# EAGLE design Thruster Ctl (EAGLE 5.11)
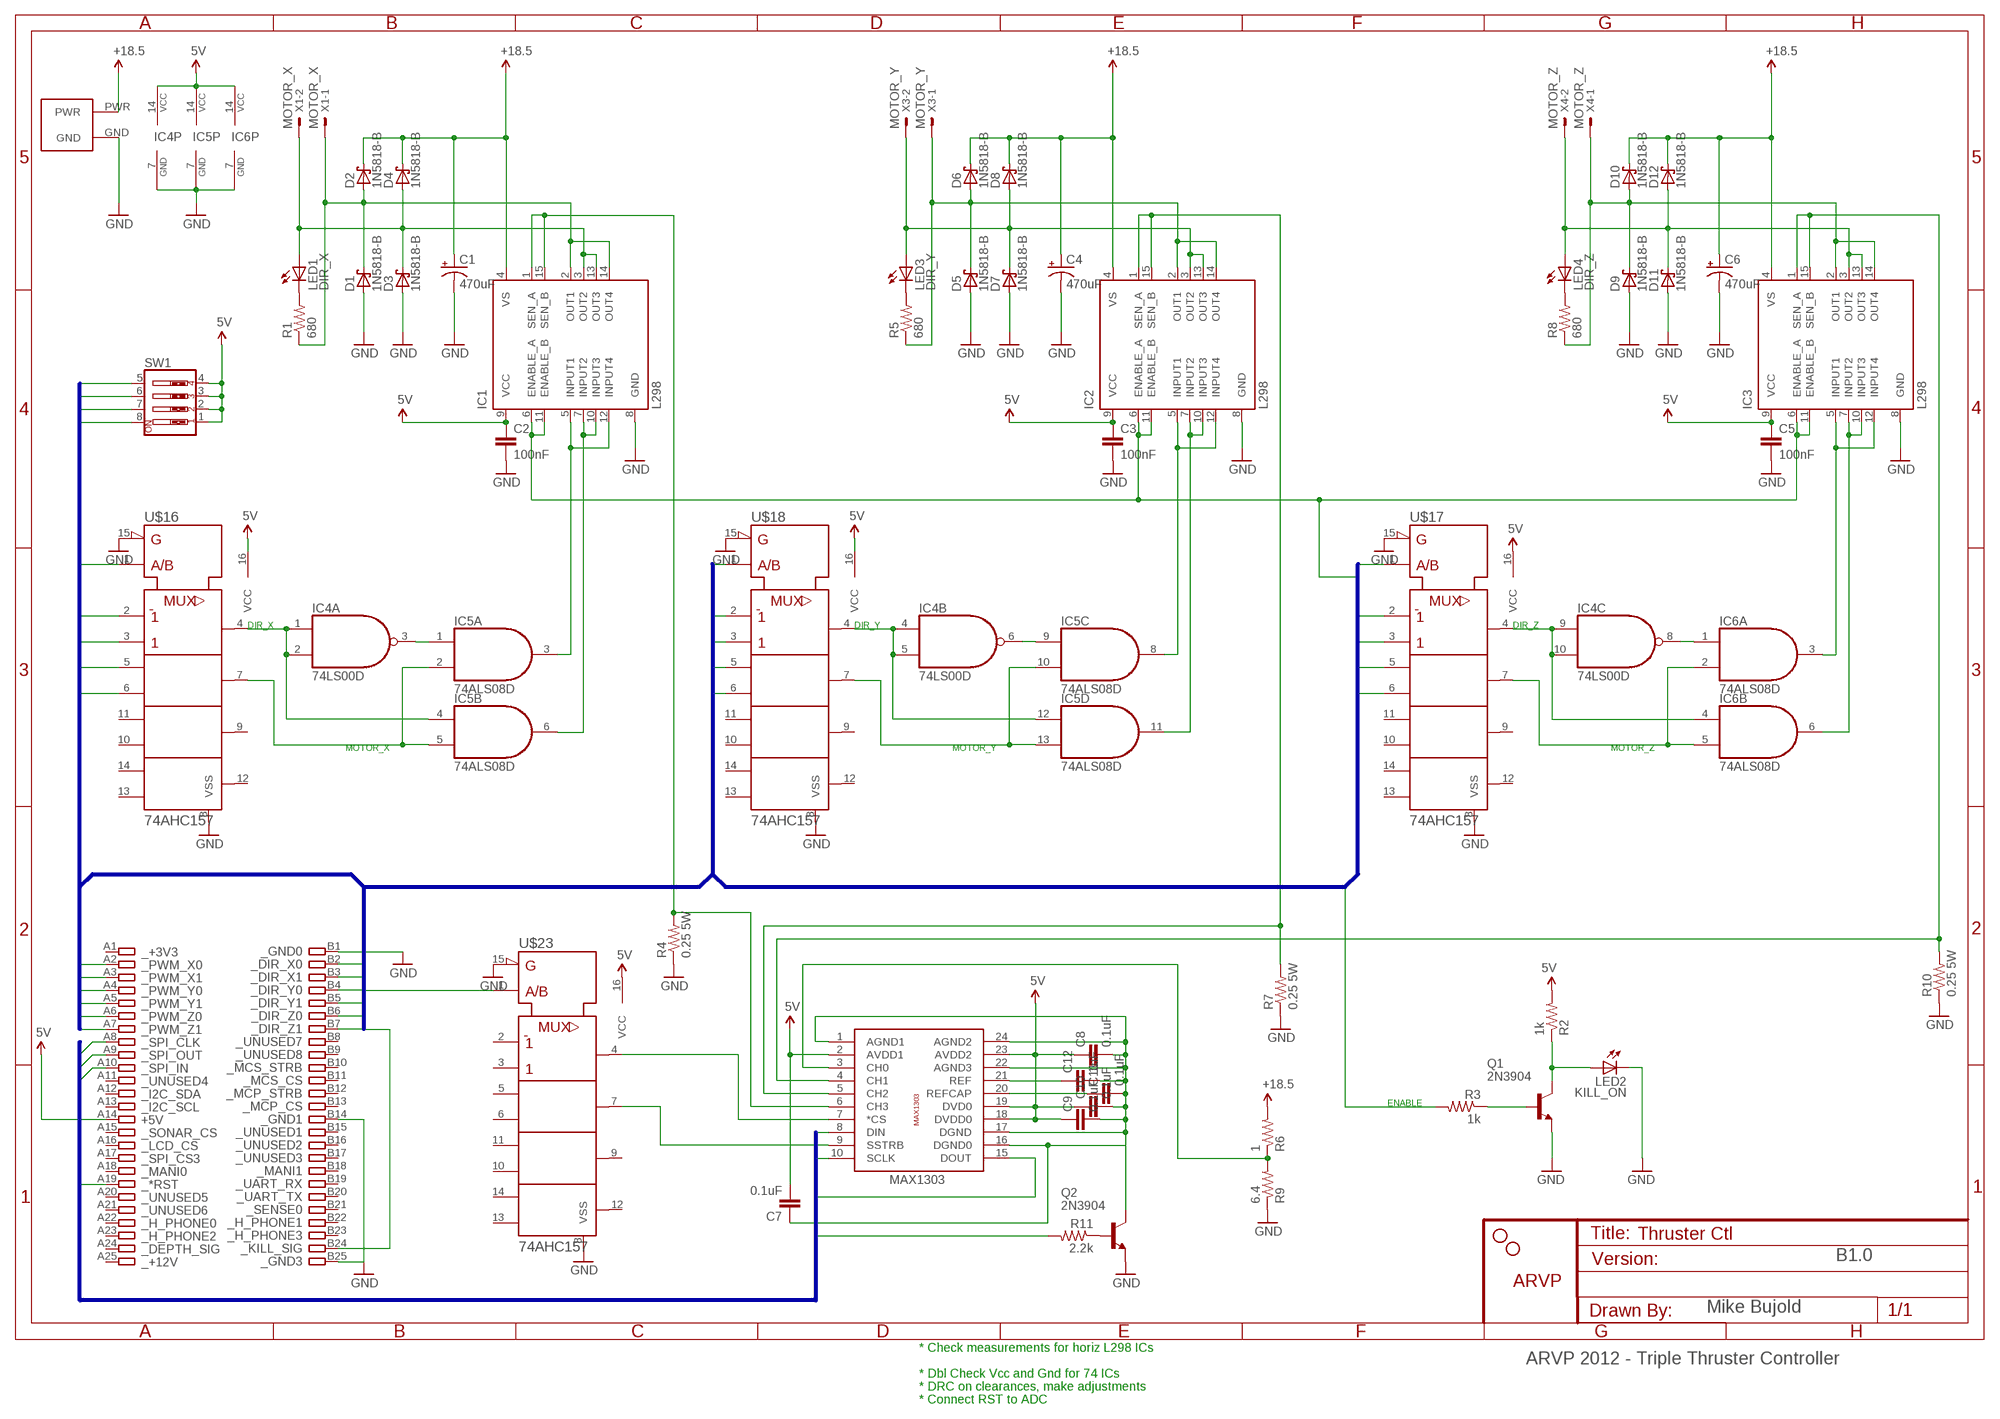
[diagram p0: schematic, sheet 1]

## Parts
C1  470uF  CAP_POLPTH4  [CPOL-RADIAL-1000UF-25V]
C2  100nF  CAPPTH  [CAP-PTH-SMALL]
C3  100nF  CAPPTH  [CAP-PTH-SMALL]
C4  470uF  CAP_POLPTH4  [CPOL-RADIAL-1000UF-25V]
C5  100nF  CAPPTH  [CAP-PTH-SMALL]
C6  470uF  CAP_POLPTH4  [CPOL-RADIAL-1000UF-25V]
C7  0.1uF  CAP1206  [1206]
C8  0.1uF  CAP1206  [1206]
C9  0.1uF  CAP1206  [1206]
C10  0.1uF  CAP1206  [1206]
C11  0.1uF  CAP1206  [1206]
C12  1uF  CAP1206  [1206]
D1  1N5818-B  [DO41-7.6]
D2  1N5818-B  [DO41-7.6]
D3  1N5818-B  [DO41-7.6]
D4  1N5818-B  [DO41-7.6]
D5  1N5818-B  [DO41-7.6]
D6  1N5818-B  [DO41-7.6]
D7  1N5818-B  [DO41-7.6]
D8  1N5818-B  [DO41-7.6]
D9  1N5818-B  [DO41-7.6]
D10  1N5818-B  [DO41-7.6]
D11  1N5818-B  [DO41-7.6]
D12  1N5818-B  [DO41-7.6]
IC1  L298  [MULTIWATT-15]
IC2  L298  [MULTIWATT-15]
IC3  L298  [MULTIWATT-15]
IC4  74LS00D  [SO14]
IC5  74ALS08D  [SO14]
IC6  74ALS08D  [SO14]
JP1  STAND-OFF  [STAND-OFF]
JP3  STAND-OFF  [STAND-OFF]
LED1  DIR_X  LED5MM  [LED5MM]
LED2  KILL_ON  LED5MM  [LED5MM]
LED3  DIR_Y  LED5MM  [LED5MM]
LED4  DIR_Z  LED5MM  [LED5MM]
Q1  2N3904  [TO92]
Q2  2N3904  [TO92]
R1  680  RESISTORPTH-1/4W  [AXIAL-0.4]
R2  1k  RESISTORPTH-1/4W  [AXIAL-0.4]
R3  1k  RESISTORPTH-1/4W  [AXIAL-0.4]
R4  0.25 5W  R-US_0922/22  [0922/22]
R5  680  RESISTORPTH-1/4W  [AXIAL-0.4]
R6  1  RESISTORPTH-1/4W  [AXIAL-0.4]
R7  0.25 5W  R-US_0922/22  [0922/22]
R8  680  RESISTORPTH-1/4W  [AXIAL-0.4]
R9  6.4  RESISTORPTH-1/4W  [AXIAL-0.4]
R10  0.25 5W  R-US_0922/22  [0922/22]
R11  2.2k  RESISTORPTH-1/4W  [AXIAL-0.4]
SW1  SW_DIP-4  [EDG-04]
U$4  ARVP_LOGO  [ARVP]
U$7  AND_PWR  [AND_PWR]
U$13  MAX1303  [MAX1303]
U$16  74AHC157  [TSSOP-16]
U$17  74AHC157  [TSSOP-16]
U$18  74AHC157  [TSSOP-16]
U$19  CARD_50PIN  [CARD_50PIN]
U$23  74AHC157  [TSSOP-16]
X1  MOTOR_X  KK-156-2  [KK-156-2]
X3  MOTOR_Y  KK-156-2  [KK-156-2]
X4  MOTOR_Z  KK-156-2  [KK-156-2]

## Nets
5V: C2.1 C3.1 C5.1 C7.2 C8.1 C9.1 C10.1 IC1.9(VCC) IC2.9(VCC) IC3.9(VCC) IC4.14(P:VCC) IC5.14(P:VCC) IC6.14(P:VCC) R2.P$2 SW1.1 SW1.2 SW1.3 SW1.4 U$13.2(AVDD1) U$13.18(DVDD0) U$13.19(DVD0) U$13.23(AVDD2) U$16.16(VCC) U$17.16(VCC) U$18.16(VCC) U$19.A14 U$23.16(VCC)
18.5V: C1.1(+) C4.1(+) C6.1(+) D2.C D4.C D6.C D8.C D10.C D12.C IC1.4(VS) IC2.4(VS) IC3.4(VS) R6.P$2 U$7.PWR ; supply symbol labelled +18.5
*RST: R11.P$2 U$19.A19
_SPI_CLK: U$13.10(SCLK) U$19.A8
_SPI_IN: U$13.15(DOUT) U$19.A10
_SPI_OUT: U$13.8(DIN) U$19.A9
DIR_X0: U$16.3(1B) U$19.B2
DIR_X1: U$16.2(1A) U$19.B3
DIR_Y0: U$18.3(1B) U$19.B4
DIR_Y1: U$18.2(1A) U$19.B5
DIR_Z0: U$17.3(1B) U$19.B6
DIR_Z1: U$17.2(1A) U$19.B7
GND: C1.2(-) C2.2 C3.2 C4.2(-) C5.2 C6.2(-) D1.A D3.A D5.A D7.A D9.A D11.A IC1.8(GND) IC2.8(GND) IC3.8(GND) IC4.7(P:GND) IC5.7(P:GND) IC6.7(P:GND) LED2.K(C) Q1.3(E) Q2.3(E) R4.1 R7.1 R9.P$1 R10.1 U$7.GND U$16.8(VSS) U$16.15(!G) U$17.8(VSS) U$17.15(!G) U$18.8(VSS) U$18.15(!G) U$19.B1 U$19.B14 U$19.B25 U$23.8(VSS) U$23.15(!G)
KILL: IC1.6(ENABLE_A) IC1.11(ENABLE_B) IC2.6(ENABLE_A) IC2.11(ENABLE_B) IC3.6(ENABLE_A) IC3.11(ENABLE_B) R3.P$2 U$19.B24
N$1: IC5.10(C:I1) IC5.13(D:I1) U$18.7(2Y)
N$3: LED2.A Q1.1(C) R2.P$1
N$4: IC2.5(INPUT1) IC2.12(INPUT4) IC5.8(C:O)
N$5: IC1.5(INPUT1) IC1.12(INPUT4) IC5.3(A:O)
N$6: IC1.7(INPUT2) IC1.10(INPUT3) IC5.6(B:O)
N$7: D1.C D2.A IC1.2(OUT1) IC1.14(OUT4) R1.P$1 X1.1
N$8: D3.C D4.A IC1.3(OUT2) IC1.13(OUT3) LED1.A X1.2
N$9: LED1.K(C) R1.P$2
N$10: IC2.7(INPUT2) IC2.10(INPUT3) IC5.11(D:O)
N$11: D5.C D6.A IC2.2(OUT1) IC2.14(OUT4) R5.P$1 X3.1
N$12: D7.C D8.A IC2.3(OUT2) IC2.13(OUT3) LED3.A X3.2
N$13: IC4.8(C:O) IC6.1(A:I0)
N$14: LED3.K(C) R5.P$2
N$16: IC3.5(INPUT1) IC3.12(INPUT4) IC6.3(A:O)
N$17: IC3.7(INPUT2) IC3.10(INPUT3) IC6.6(B:O)
N$18: D9.C D10.A IC3.2(OUT1) IC3.14(OUT4) R8.P$1 X4.1
N$19: D11.C D12.A IC3.3(OUT2) IC3.13(OUT3) LED4.A X4.2
N$21: LED4.K(C) R8.P$2
N$22: C7.1 C8.2 C9.2 C10.2 C11.2 C12.2 Q2.1(C) U$13.1(AGND1) U$13.16(DGND0) U$13.17(DGND) U$13.22(AGND3) U$13.24(AGND2)
N$23: IC6.2(A:I1) IC6.5(B:I1) U$17.7(2Y)
N$24: IC3.1(SEN_A) IC3.15(SEN_B) R10.2 U$13.4(CH1)
N$25: IC4.6(B:O) IC5.9(C:I0)
N$26: IC5.2(A:I1) IC5.5(B:I1) U$16.7(2Y)
N$27: IC4.3(A:O) IC5.1(A:I0)
N$28: Q1.2(B) R3.P$1
N$29: IC2.1(SEN_A) IC2.15(SEN_B) R7.2 U$13.5(CH2)
N$30: IC1.1(SEN_A) IC1.15(SEN_B) R4.2 U$13.6(CH3)
N$32: U$13.7(*CS) U$23.4(1Y)
N$33: C11.1 U$13.20(REFCAP)
N$34: C12.1 U$13.21(REF)
N$35: U$13.9(SSTRB) U$23.7(2Y)
N$36: IC4.1(A:I0) IC4.2(A:I1) IC5.4(B:I0) U$16.4(1Y)
N$37: IC4.4(B:I0) IC4.5(B:I1) IC5.12(D:I0) U$18.4(1Y)
N$38: IC4.9(C:I0) IC4.10(C:I1) IC6.4(B:I0) U$17.4(1Y)
N$39: R6.P$1 R9.P$2 U$13.3(CH0)
N$40: Q2.2(B) R11.P$1
PWM_X0: U$16.6(2B) U$19.A2
PWM_X1: U$16.5(2A) U$19.A3
PWM_Y0: U$18.6(2B) U$19.A4
PWM_Y1: U$18.5(2A) U$19.A5
PWM_Z0: U$17.6(2B) U$19.A6
PWM_Z1: U$17.5(2A) U$19.A7
SEL_X: SW1.8 U$16.1(!A/B)
SEL_Y: SW1.7 U$18.1(!A/B)
SEL_Z: SW1.6 U$17.1(!A/B)
SIDE: SW1.5 U$23.1(!A/B)
Unconnected: IC4.11(D:O) IC4.12(D:I0) IC4.13(D:I1) IC6.8(C:O) IC6.9(C:I0) IC6.10(C:I1) IC6.11(D:O) IC6.12(D:I0) IC6.13(D:I1) U$16.9(3Y) U$16.10(3B) U$16.11(3A) U$16.12(4Y) U$16.13(4B) U$16.14(4A) U$17.9(3Y) U$17.10(3B) U$17.11(3A) U$17.12(4Y) U$17.13(4B) U$17.14(4A) U$18.9(3Y) U$18.10(3B) U$18.11(3A) U$18.12(4Y) U$18.13(4B) U$18.14(4A) U$19.A1 U$19.A11 U$19.A12 U$19.A13 U$19.A15 U$19.A16 U$19.A17 U$19.A18 U$19.A20 U$19.A21 U$19.A22 U$19.A23 U$19.A24 U$19.A25 U$19.B8 U$19.B9 U$19.B10 U$19.B11 U$19.B12 U$19.B13 U$19.B15 U$19.B16 U$19.B17 U$19.B18 U$19.B19 U$19.B20 U$19.B21 U$19.B22 U$19.B23 U$23.2(1A) U$23.3(1B) U$23.5(2A) U$23.6(2B) U$23.9(3Y) U$23.10(3B) U$23.11(3A) U$23.12(4Y) U$23.13(4B) U$23.14(4A)

## Buses
_SPI_IN,_SPI_OUT,_SPI_CLK,_ADC_CS,ADC_STRB,*RST
PWM_X0,DIR_X0,PWM_X1,DIR_X1,PWM_Y0,DIR_Y0,PWM_Y1,DIR_Y1,PWM_Z0,DIR_Z0,PWM_Z1,DIR_Z1,SEL_X,SEL_Y,SEL_Z,KILL,SIDE

## Notes on the sheet
- DIR_X | DIR_Y | DIR_Z
- MOTOR_X | MOTOR_Y | MOTOR_Z
- ENABLE
- B1.0
- Mike Bujold
- * Check measurements for horiz L298 ICs
- ARVP 2012 - Triple Thruster Controller
- * Dbl Check Vcc and Gnd for 74 ICs
- * DRC on clearances, make adjustments
- * Connect RST to ADC

## Library data of the parts
C1 C4 C6 = SparkFun:CAP_POL: Capacitor Polarized These are standard SMD and PTH capacitors. Normally 10uF, 47uF, and 100uF in electrolytic and tantalum varieties. Always verify the external diameter of the through hole cap, it varies with capacity, voltage, and manufacturer. The EIA devices should be standard.
C2 C3 C5 C7-C12 = SparkFun:CAP: Capacitor Standard 0603 ceramic capacitor, and 0.1" leaded capacitor.
D1-D12 = diode:1N581*: 1.0A SCHOTTKY BARRIER RECTIFIER Source: http://www.diodes.com/datasheets/ds23001.pdf
IC1-IC3 = st-microelectronics:L298: DUAL FULL-BRIDGE DRIVER; MPN: L298N; OC_FARNELL: 1589425; OC_NEWARK: 32M1527
IC4 = 74xx-us:74*00: Quad 2-input NAND gate
IC5 IC6 = 74xx-us:74*08: Quad 2-input AND gate
JP1 JP3 = SparkFun:STAND-OFF: Stand Off This is the mechanical footprint for a #4 phillips button head screw. Use the keepout ring to avoid running the screw head into surrounding components. SKU : PRT-00447
LED1-LED4 = led:LED: LED OSRAM: - CHIPLED LG R971, LG N971, LY N971, LG Q971, LY Q971, LO R971, LY R971 LH N974, LH R974 LS Q976, LO Q976, LY Q976 LO Q996 - Hyper CHIPLED LW Q18S LB Q993, LB Q99A, LB R99A - SideLED LS A670, LO A670, LY A670, LG A670, LP A670 LB A673, LV A673, LT A673, LW A673 LH A674 LY A675 LS A676, LA A676, LO A676, LY A676, LW A676 LS A679, LY A679, LG A679 - Hyper Micro SIDELED® LS Y876, LA Y876, LO Y876, LY Y876 LT Y87S - SmartLED LW L88C, LW L88S LB L89C, LB L89S, LG L890 LS L89K, LO L89K, LY L89K LS L896, LA L896, LO L896, LY L896 - TOPLED LS T670, LO T670, LY T670, LG T670, LP T670 LSG T670, LSP T670, LSY T670, LOP T670, LYG T670 LG T671, LOG T671, LSG T671 LB T673, LV T673, LT T673, LW T673 LH T674 LS T676, LA T676, LO T676, LY T676, LB T676, LH T676, LSB T676, LW T676 LB T67C, LV T67C, LT T67C, LS T67K, LO T67K, LY T67K, LW E67C LS E67B, LA E67B, LO E67B, LY E67B, LB E67C, LV E67C, LT E67C LW T67C LS T679, LY T679, LG T679 LS T770, LO T770, LY T770, LG T770, LP T770 LB T773, LV T773, LT T773, LW T773 LH T774 LS E675, LA E675, LY E675, LS T675 LS T776, LA T776, LO T776, LY T776, LB T776 LHGB T686 LT T68C, LB T68C - Hyper Mini TOPLED® LB M676 - Mini TOPLED Santana® LG M470 LS M47K, LO M47K, LY M47K Source: http://www.osram.convergy.de LUXEON: - LUMILED® LXK2-PW12-R00, LXK2-PW12-S00, LXK2-PW14-U00, LXK2-PW14-V00 LXK2-PM12-R00, LXK2-PM12-S00, LXK2-PM14-U00 LXK2-PE12-Q00, LXK2-PE12-R00, LXK2-PE12-S00, LXK2-PE14-T00, LXK2-PE14-U00 LXK2-PB12-K00, LXK2-PB12-L00, LXK2-PB12-M00, LXK2-PB14-N00, LXK2-PB14-P00, LXK2-PB14-Q00 LXK2-PR12-L00, LXK2-PR12-M00, LXK2-PR14-Q00, LXK2-PR14-R00 LXK2-PD12-Q00, LXK2-PD12-R00, LXK2-PD12-S00 LXK2-PH12-R00, LXK2-PH12-S00 LXK2-PL12-P00, LXK2-PL12-Q00, LXK2-PL12-R00 Source: www.luxeon.com KINGBRIGHT: KA-3528ASYC Source: www.kingbright.com
Q1 Q2 = transistor-npn:2N3904: NPN Transistor
R1-R3 R5 R6 R8 R9 R11 = SparkFun:RESISTOR: Resistor Basic schematic elements and footprints for 0603, 1206, and PTH resistors.
R4 R7 R10 = resistor:R-US_: RESISTOR, American symbol
SW1 = special:SW_DIP-4: DIP SWITCH
U$4 = ARVP:ARVP_LOGO
U$7 = ARVP:AND_PWR
U$13 = ARVP:MAX1303
U$16-U$18 U$23 = ARVP:74AHC157
U$19 = ARVP:CARD_50PIN
X1 X3 X4 = con-molex:KK-156-2: KK 156 HEADER Source: http://www.molex.com/pdm_docs/sd/026604100_sd.pdf; OC_FARNELL: unknown; OC_NEWARK: unknown

## Board
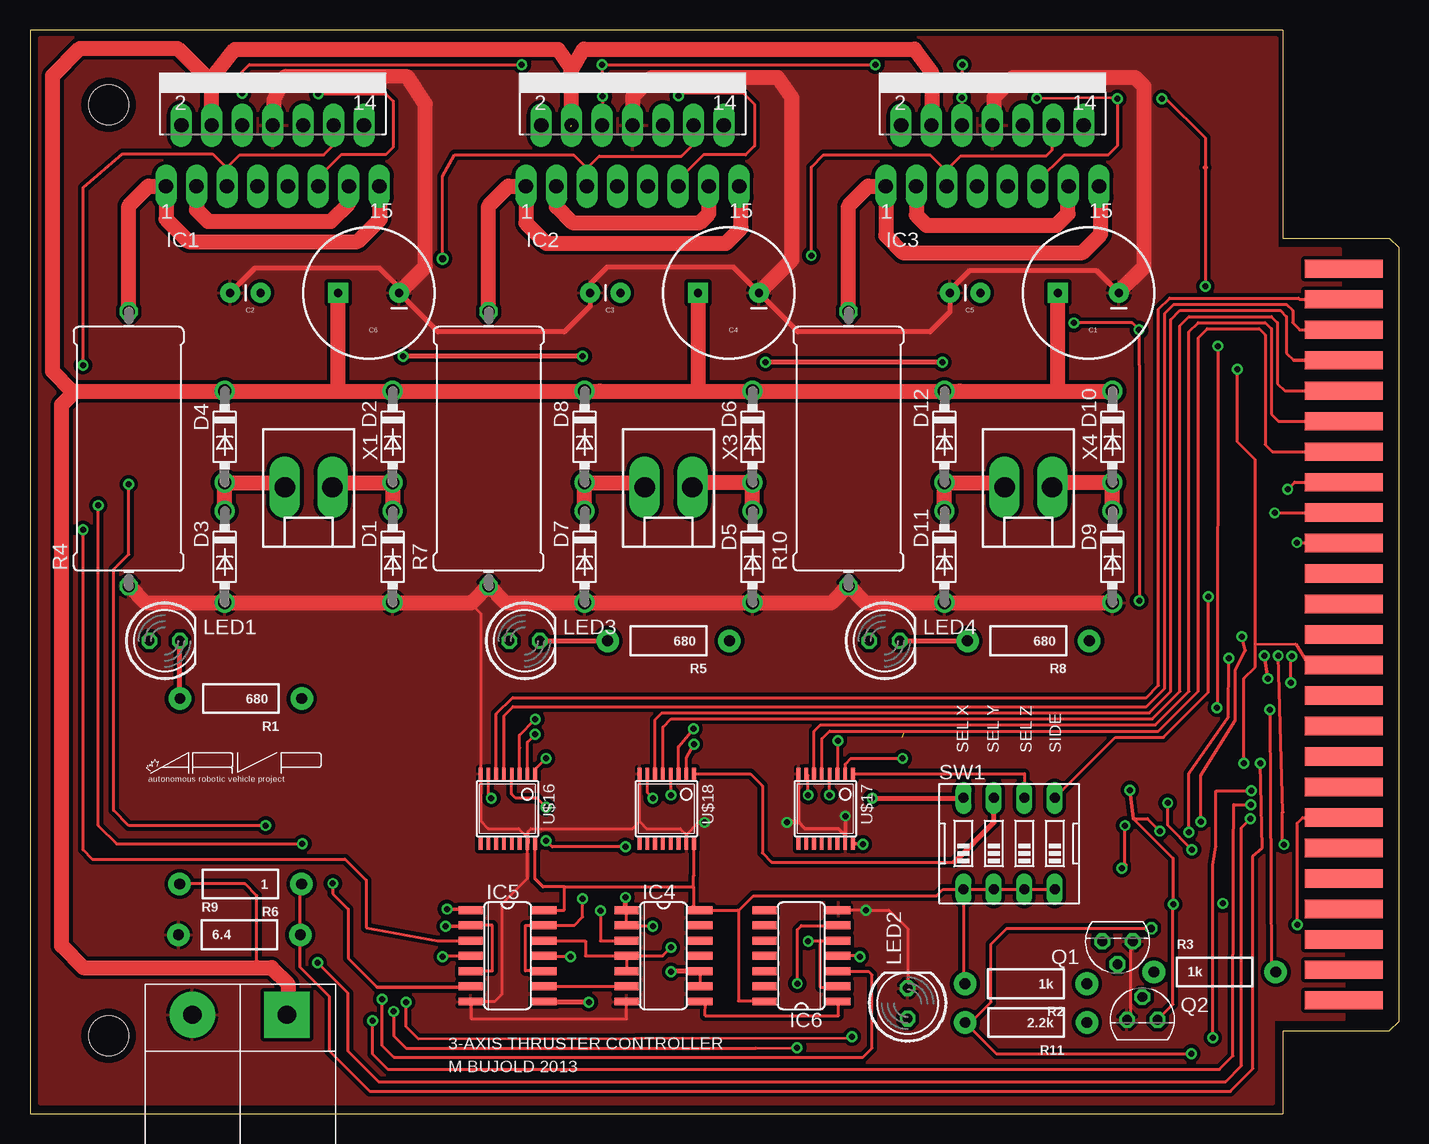
[diagram p1: board, top side]
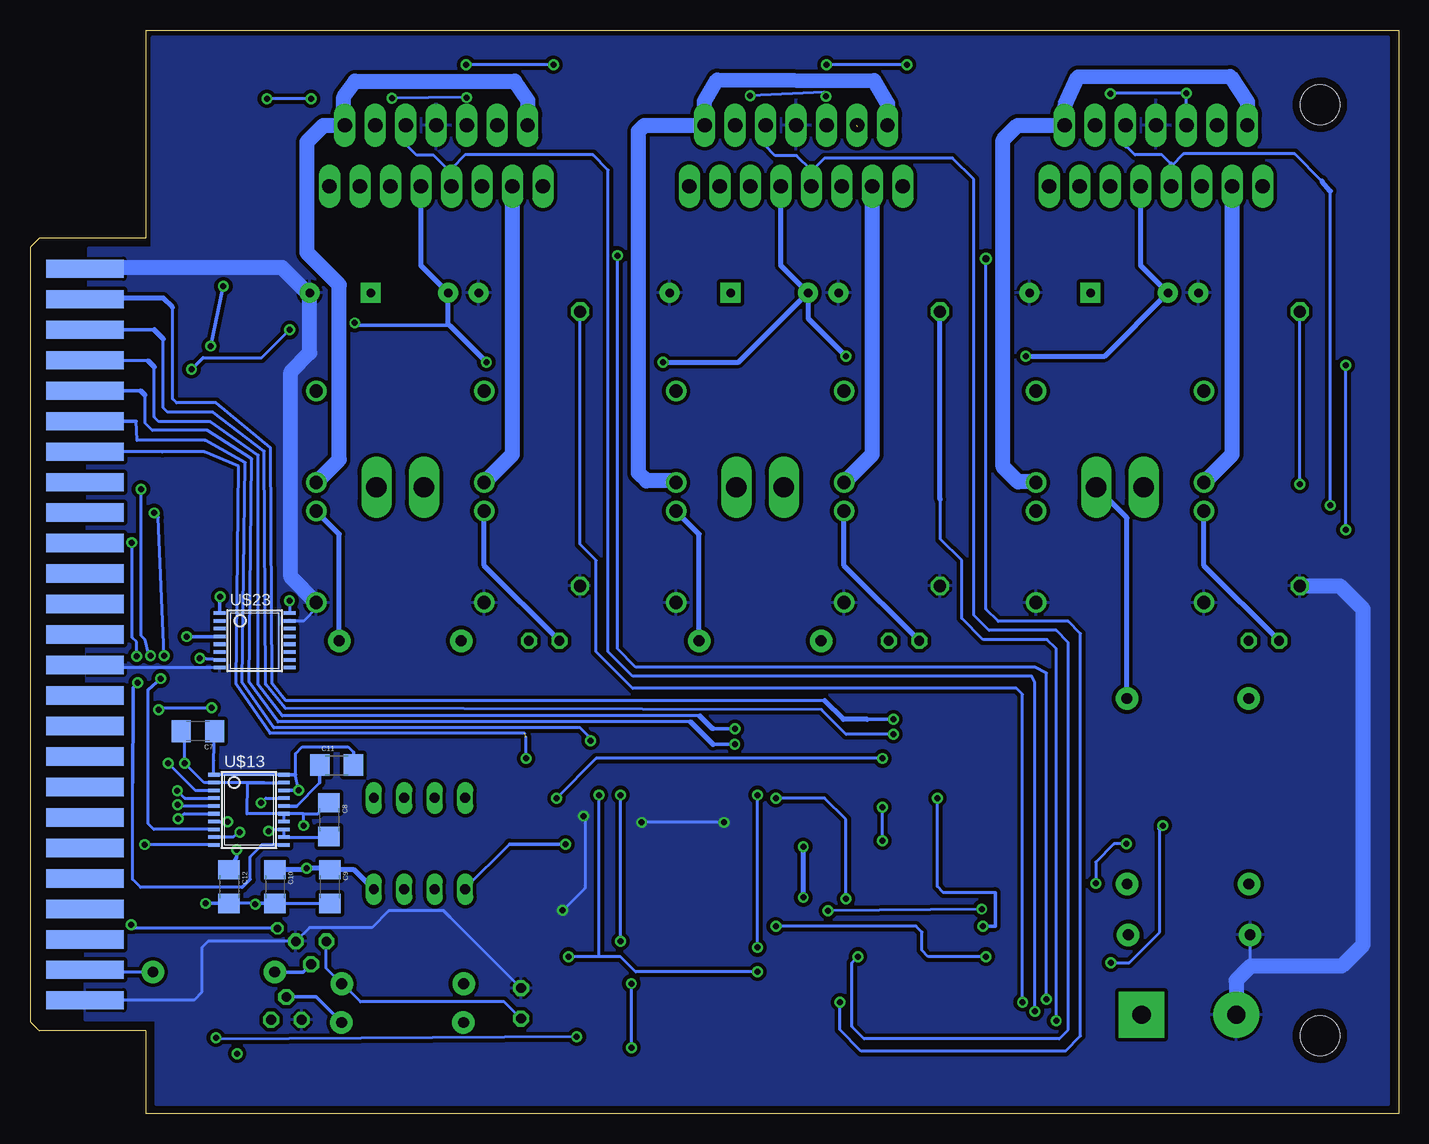
[diagram p2: board, bottom side, seen from below]

Size 114.09 x 90.32 mm. Coordinates in mm from the lower left corner, seen from the top.
Outline: 104.44,75.29 104.44,90.32 0,90.32 0,0 104.44,0 104.44,4.4
Copper layers (1*16): Top 0.035mm / dielectric 1.5mm / Bottom 0.035mm
Design rules "default *": minimum track width 10mil, minimum drill 19mil, track to track 7mil, track to pad 7mil, pad to pad 7mil, via to via 7mil, smd to smd 7mil, copper to edge 10mil, drill to drill 8mil, minimum pad ring 10mil, minimum via ring 8mil, stop-mask expansion 4mil, vias tented up to drill 0mil, thermal gap 10mil

### Footprints (pad centres in the part's own frame; a part is rotated, then mirrored left to right if it is on the bottom)
CPOL-RADIAL-1000UF-25V = drill 0.7 pad 1.651 square: 1 2.54,0 | drill 0.7 pad 1.651 round: 2 -2.54,0
CAP-PTH-SMALL = drill 0.7 pad 1.651 round: 1 0,0; 2 2.54,0
1206 = smd 1.6 x 1.8: 1 -1.4,0; 2 1.4,0
DO41-7.6 = drill 1.1 pad 1.7 round: A 3.81,0; C -3.81,0
MULTIWATT-15 = drill 1.2 long: 1 -8.89,-7.62; 2 -7.62,-2.54; 3 -6.35,-7.62; 4 -5.08,-2.54; 5 -3.81,-7.62; 6 -2.54,-2.54; 7 -1.27,-7.62; 8 0,-2.54; 9 1.27,-7.62; 10 2.54,-2.54; 11 3.81,-7.62; 12 5.08,-2.54; 13 6.35,-7.62; 14 7.62,-2.54; 15 8.89,-7.62
SO14 = smd 0.66 x 2.032: 1 -3.81,-3.073; 2 -2.54,-3.073; 3 -1.27,-3.073; 4 0,-3.073; 5 1.27,-3.073; 6 2.54,-3.073; 7 3.81,-3.073; 8 3.81,3.073; 9 2.54,3.073; 10 1.27,3.073; 11 0,3.073; 12 -1.27,3.073; 13 -2.54,3.073; 14 -3.81,3.073
STAND-OFF = hole 3.302: 0,0
LED5MM = drill 0.813 octagon: A -1.27,0; K 1.27,0
TO92 = drill 0.813 octagon: 1 1.27,0; 2 0,1.905; 3 -1.27,0
AXIAL-0.4 = drill 0.9 pad 1.88 round: P$1 -5.08,0; P$2 5.08,0
0922/22 = drill 1.016 octagon: 1 -11.43,0; 2 11.43,0
EDG-04 = drill 0.813 long: 1 -3.81,-3.81; 2 -1.27,-3.81; 3 1.27,-3.81; 4 3.81,-3.81; 5 3.81,3.81; 6 1.27,3.81; 7 -1.27,3.81; 8 -3.81,3.81
AND_PWR = drill 1.524 pad 3.81 round: GND 0,-7.886 | drill 1.524 pad 3.81 square: PWR 0,0
MAX1303 = smd 0.305 x 0.991: 1 -3.575,-2.918; 2 -2.925,-2.918; 3 -2.275,-2.918; 4 -1.625,-2.918; 5 -0.975,-2.918; 6 -0.325,-2.918; 7 0.325,-2.918; 8 0.975,-2.918; 9 1.625,-2.918; 10 2.275,-2.918; 15 2.275,2.918; 16 1.625,2.918; 17 0.975,2.918; 18 0.325,2.918; 19 -0.325,2.918; 20 -0.975,2.918; 21 -1.625,2.918; 22 -2.275,2.918; 23 -2.925,2.918; 24 -3.575,2.918
TSSOP-16 = smd 0.305 x 0.991: 1 -2.305,-2.918; 2 -1.655,-2.918; 3 -1.005,-2.918; 4 -0.355,-2.918; 5 0.295,-2.918; 6 0.945,-2.918; 7 1.595,-2.918; 8 2.245,-2.918; 9 2.245,2.918; 10 1.595,2.918; 11 0.945,2.918; 12 0.295,2.918; 13 -0.355,2.918; 14 -1.005,2.918; 15 -1.655,2.918; 16 -2.305,2.918
CARD_50PIN = smd 1.524 x 6.477: A1 63.5,3.81; A2 60.96,3.81; A3 58.42,3.81; A4 55.88,3.81; A5 53.34,3.81; A6 50.8,3.81; A7 48.26,3.81; A8 45.72,3.81; A9 43.18,3.81; A10 40.64,3.81; A11 38.1,3.81; A12 35.56,3.81; A13 33.02,3.81; A14 30.48,3.81; A15 27.94,3.81; A16 25.4,3.81; A17 22.86,3.81; A18 20.32,3.81; A19 17.78,3.81; A20 15.24,3.81; A21 12.7,3.81; A22 10.16,3.81; A23 7.62,3.81; A24 5.08,3.81; A25 2.54,3.81 | smd 1.524 x 6.477 bottom: B1 63.5,3.81; B2 60.96,3.81; B3 58.42,3.81; B4 55.88,3.81; B5 53.34,3.81; B6 50.8,3.81; B7 48.26,3.81; B8 45.72,3.81; B9 43.18,3.81; B10 40.64,3.81; B11 38.1,3.81; B12 35.56,3.81; B13 33.02,3.81; B14 30.48,3.81; B15 27.94,3.81; B16 25.4,3.81; B17 22.86,3.81; B18 20.32,3.81; B19 17.78,3.81; B20 15.24,3.81; B21 12.7,3.81; B22 10.16,3.81; B23 7.62,3.81; B24 5.08,3.81; B25 2.54,3.81
KK-156-2 = drill 1.7 pad 2.184 long: 1 -1.98,0; 2 1.98,0

### Placement (x,y rotation side)
C1  88.23,68.42 180 top
C2  19.23,68.42 180 top
C3  49.23,68.42 180 top
C4  58.23,68.42 180 top
C5  79.23,68.42 180 top
C6  28.23,68.42 180 top
C7  100.1,31.89 180 bottom
C8  89.16,24.52 270 bottom
C9  89.11,18.93 270 bottom
C10  93.68,18.93 270 bottom
C11  88.53,29.07 0 bottom
C12  97.5,18.94 270 bottom
D1  30.23,46.42 270 top
D2  30.23,56.42 270 top
D3  16.23,46.42 270 top
D4  16.23,56.42 270 top
D5  60.23,46.42 270 top
D6  60.23,56.42 270 top
D7  46.23,46.42 270 top
D8  46.23,56.42 270 top
D9  90.23,46.42 270 top
D10  90.23,56.42 270 top
D11  76.23,46.42 270 top
D12  76.23,56.42 270 top
IC1  20.23,84.92 0 top
IC2  50.23,84.92 0 top
IC3  80.23,84.92 0 top
IC4  52.81,13.17 270 top
IC5  39.81,13.17 270 top
IC6  64.31,13.17 90 top
JP1  6.55,6.5 0 top
JP3  6.55,84.1 0 top
LED1  11.23,39.42 0 top
LED2  73.16,9.21 90 top
LED3  41.23,39.42 0 top
LED4  71.23,39.42 0 top
Q1  90.66,14.37 180 top
Q2  92.73,7.84 0 top
R1  17.57,34.61 180 top
R2  83.02,10.84 180 top
R3  98.77,11.82 0 top
R4  8.23,55.42 90 top
R5  53.23,39.42 180 top
R6  17.56,19.16 180 top
R7  38.23,55.42 90 top
R8  83.23,39.42 180 top
R9  17.46,14.92 0 top
R10  68.23,55.42 90 top
R11  83.04,7.62 180 top
SW1  81.62,22.52 0 top
U$4  9.83,27.66 0 top
U$7  21.42,8.25 270 top
U$13  95.84,24.69 270 bottom
U$16  39.81,25.42 180 top
U$17  66.31,25.42 180 top
U$18  53.06,25.42 180 top
U$19  113.33,6.92 90 top
U$23  95.36,39.43 270 bottom
X1  23.23,52.22 180 top
X3  53.23,52.22 180 top
X4  83.23,52.22 180 top

### Tracks (layer width: path | path; a pad name or v marks a point on that pad's centre or on a via)
5V  (via drill 0.5)
  Top 0.254: IC5.14 44.56,16.98 44.56,18.93 | 44.56,18.93 55.31,18.93 | IC4.14 59,16.98 59.06,16.92 | 59.06,16.92 59.06,9.42 61.17,9.42 | 55.31,18.93 55.31,17.23 | SW1.4 SW1.3 SW1.2 SW1.1 | 91.29,20.73 v91.29,24.03 | 106.68,37.26 105.5,39.16 102.13,39.12 102.13,37.22 | 102.13,37.22 101.21,36.3 v101.18,29.22 | 102.13,37.22 102.13,54.52 100.63,56.03 v100.63,62.05 | v92.46,42.75 92.46,62.39 v92.46,65.33 91.88,65.91 v87.01,65.91 | 42.1,19.58 U$16.16 | 44.56,18.93 42.76,18.93 | U$18.16 55.37,19.87 55.31,19.81 55.31,18.93 | 59.06,16.92 60.3,18.17 75.56,18.17 76.11,18.71 SW1.1 | R2.P$2 77.81,10.97 SW1.1
  Top 0.305: U$19.A14 109.37,37.25 106.68,37.26 | U$16.16 | 42.76,18.93 42.1,19.58 | U$18.16 | v69.44,22.48 69.41,22.5 U$17.16
  Top 0.406: 61.17,9.42 IC6.14 | IC4.14 55.82,16.92 55.31,16.92 55.36,16.98 55.36,17.17 55.31,17.23 | v46.08,63.14 v31.09,63.14 | v76.05,62.64 v61.32,62.64 | v91.03,20.47 91.29,20.73
  Bottom 0.254: 94.55,27.61 U$13.2 99.57,27.61 v101.18,29.22 | U$13.18 U$13.19 91.29,25.01 | C8.1 90.07,25.01 91.29,25.01 | v91.29,24.03 91.29,25.01 | 92.44,42.73 U$23.16 | v101.18,29.22 101.21,29.09 | 94.55,27.61 U$13.23 | 94.55,27.61 95.97,27.61 96,25.01 U$13.19 | v101.18,29.22 101.18,31.57 C7.2 | 99.66,63.02 94.76,63.02 v92.46,65.33 | 74.12,22.48 77.81,18.78 SW1.1
  Bottom 0.305: v100.63,62.05 99.66,63.02 | v87.01,65.91 86.81,65.71 79.12,65.71 | v92.46,42.75 92.44,42.73 | 74.12,22.48 v69.44,22.48 | U$13.19
  Bottom 0.406: IC1.9 21.5,70.69 C2.1 24.51,63.14 v31.09,63.14 | C3.1 51.5,70.69 IC2.9 | IC3.9 81.5,70.69 C5.1 79.23,65.82 79.12,65.71 v76.05,62.64 | v46.08,63.14 49.23,66.3 C3.1 | C3.1 55.02,62.64 v61.32,62.64 | C10.1 91.17,20.33 v91.03,20.47 89.25,20.47 C9.1 87.05,20.33 SW1.4
18.5V  (1 unrouted)
  Top 0.254: R6.P$2 17.93,19.16 18.9,18.19 18.9,12.2
  Top 1.27: D8.C 47.5,60.23 | D12.C 77.5,60.23 | D12.C D6.C 55.73,60.23 | D8.C D2.C 25.71,60.23 | 25.71,60.23 D4.C 3.77,60.23 | D8.C 55.73,60.23 | D12.C 85.7,60.23 | 85.7,60.23 D10.C | C6.1 25.71,68.42 25.71,60.23 | C4.1 55.73,68.42 55.73,60.23 | C1.1 85.7,68.42 85.7,60.23 | 45.1,86.9 45.1,87.13 44.04,88.71 17.08,88.71 15.15,86.27 IC1.4 15.09,82.44 15.09,86 12.29,88.8 4.17,88.8 1.88,86.51 1.88,61.87 3.52,60.23 3.77,60.23 | 3.77,60.23 2.63,59.09 2.63,13.99 4.43,12.2 18.9,12.2 20.15,12.2 21.51,10.84 21.51,8.34 U$7.PWR | 45.1,86.9 45.1,82.25 | 45.1,86.9 46.16,88.72 73.73,88.72 75.18,86.77 75.18,82.41 IC3.4
*RST  (via drill 0.5, 0.6)
  Top 0.254: R11.P$2 80.55,5.03 v96.81,5.03 | U$19.A19 106.09,24.69 105.63,24.23 v105.66,15.75 | v93.46,15.45 81.43,15.45 80.11,14.14 80.11,9.31 78.42,7.62
  Top 0.305: U$19.A19 | R11.P$2 78.42,7.62
  Bottom 0.254: v93.46,15.45 105.46,15.45
  Bottom 0.305: v96.81,5.03 96.85,4.98 | 105.46,15.45 v105.66,15.75
_SPI_CLK  (via drill 0.5)
  Top 0.254: U$19.A8 105.43,52.64 v104.84,52.05 | 104.44,25.14 v104.05,38.18 | 104.41,22.58 104.41,25.11
  Top 0.305: 104.41,25.11 104.44,25.14 | v104.54,22.45 104.41,22.58
  Bottom 0.254: v104.84,52.05 104.84,39.86 104.51,39.53 104.21,38.25 | 98.8,22.45 v104.54,22.45
  Bottom 0.305: v104.05,38.18 104.21,38.25 | U$13.10 98.8,22.45
_SPI_IN  (via drill 0.5)
  Top 0.254: v105.1,35.92 105.1,38.05 v105.2,38.15 | v105.62,47.61 109.47,47.61
  Top 0.305: 109.47,47.61 U$19.A10
  Bottom 0.254: 94.73,22.41 95.72,21.42 95.72,19.55 | 96.39,18.88 104.87,18.88 105.54,19.55 105.54,27.6 | v105.2,38.15 105.2,39.33 105.56,39.69 105.56,47.55
  Bottom 0.305: 94.73,22.41 U$13.15 | 96.39,18.88 95.72,19.55 | 105.54,27.6 105.49,34.18 105.49,35.52 v105.1,35.92 | 105.56,47.55 v105.62,47.61
_SPI_OUT  (via drill 0.5)
  Top 0.254: v103.75,50.08 109.49,50.08
  Top 0.305: v103.19,36.28 v102.9,38.18 | 109.49,50.08 U$19.A9
  Bottom 0.254: U$13.8 103.77,23.71 104.22,24.16 104.22,35.35 | v102.9,38.18 103.39,49.71
  Bottom 0.305: 104.22,35.35 v103.19,36.28 | 103.39,49.71 v103.75,50.08
DIR_X0  (via drill 0.5)
  Top 0.254: U$16.3 40.81,30.51 | 40.8,30.52 40.8,31.56 v42.12,32.87
  Top 0.305: 40.81,30.51 40.8,30.52
  Bottom 0.254: 47.85,34.44 92.76,34.44 93.91,35.86 94.03,55.52 98.57,59.25 101.87,59.25 102.21,59.59 102.21,67.21
  Bottom 0.305: v42.12,32.87 44.29,32.87
  Bottom 0.406: 44.29,32.87 46.29,32.87 47.85,34.44 | 102.21,67.21 102.97,67.97 109.43,67.97 U$19.B2
DIR_X1  (via drill 0.5)
  Top 0.254: U$16.2 41.46,30.98 v42.11,31.63
  Bottom 0.254: v42.11,31.63 46.06,31.63 48.11,33.68 92.81,33.78 94.45,35.79 94.55,55.22 98.82,58.49 102.63,58.49 102.97,58.83 102.97,64.58
  Bottom 0.305: U$19.B3 103.73,65.35
  Bottom 0.406: 102.97,64.58 103.73,65.35
DIR_Y0  (via drill 0.5)
  Top 0.254: U$18.3 54.06,30.6 v55.31,32.1
  Bottom 0.254: 58.27,33.17 93.07,33.17 95.07,35.77 95.07,54.89 99.03,57.68 103.35,57.68 103.73,58.06 103.73,62.25 | 104.24,62.76 109.48,62.76
  Bottom 0.305: U$19.B4 109.52,62.76 | v55.31,32.1 57.14,32.1
  Bottom 0.406: 57.14,32.1 57.2,32.1 58.27,33.17 | 103.73,62.25 104.24,62.76 | 109.48,62.76 U$19.B4
DIR_Y1  (via drill 0.5)
  Top 0.254: U$18.2 54.71,29.66 v55.34,30.8
  Bottom 0.254: 104.5,59.89 104.5,57.56 103.9,56.96 99.32,56.96 95.61,54.59 95.81,35.98 93.42,32.66 59.03,32.66
  Bottom 0.305: U$19.B5 arc-90 U$19.B5 104.86,60.26 | v55.34,30.8 57.14,30.8
  Bottom 0.406: 57.14,30.8 57.16,30.8 59.03,32.66 | 104.5,59.89 104.86,60.26
DIR_Z0  (via drill 0.5)
  Top 0.254: v67.36,31.09 67.36,28.39 U$17.3
  Bottom 0.254: 105.25,57.72 105.17,56.12 99.5,56.12 96.15,54.26 96.4,35.92 93.78,32.16 68.22,32.16 67.36,31.29 v67.36,31.09
  Bottom 0.305: 105.25,57.72 U$19.B6
DIR_Z1  (via drill 0.5)  (1 unrouted)
  Top 0.254: U$17.2 67.96,29.15 68.43,29.62 v72.75,29.62
  Bottom 0.254: 103.08,55.18 U$19.B7 | 103.07,55.17 99.56,55.17 96.72,53.96 96.92,35.82 94.08,31.7 72.85,31.7 | v72.75,29.62 72.75,31.39
  Bottom 0.305: 103.07,55.17 103.08,55.18
GND  (via drill 0.5)
  Top 0.254: 36.81,9.36 36.81,7.92 49.73,7.92 IC4.7 | 41.5,23.01 40.74,23.77 38.2,23.77 37.56,24.42 U$16.8 37.56,41.73 36.68,42.61 | 41.5,23.01 41.5,22.55 | 50.81,24.37 U$18.8 | 50.81,24.37 51.41,23.77 54.2,23.77 54.71,23.27 55.73,24.28 | 41.5,23.01 41.5,23.52 41.76,23.77 50.21,23.77 50.81,24.37 | U$16.15 41.45,19.61 39.31,17.46 39.31,9.93 38.74,9.36 IC5.7 | IC6.7 v69.69,16.98 71.6,16.98 73.17,15.41 73.17,10.49 | Q2.3 91.74,8.12 91.74,13.61 91.93,13.8 Q1.3
  Top 0.305: 41.5,22.55 U$16.15 | 54.71,23.27 U$18.15 | U$17.8 64.06,24.33 64.62,23.77 67.41,23.77 67.92,23.27 67.92,22.55 U$17.15 v67.96,24.82 | v69.7,16.98 v69.69,16.98
  Top 0.406: 15.73,42.61 15.98,42.36 | C2.2 18.74,70.47 29.12,70.47 30.77,68.82 C6.2 34.02,65.18 44.55,65.18 46.69,67.31 C3.2 46.69,69.15 48.1,70.55 58.64,70.55 C4.2 64.02,65.18 75.03,65.18 76.69,66.83 C5.2 76.69,68.62 78.32,70.25 88.94,70.25 C1.2 | 55.73,24.28 v56.24,24.28 | v63.09,24.28 63.14,24.33 64.06,24.33 | 73.17,10.49 LED2.K
  Top 1.27: R4.1 9.61,42.61 15.73,42.61 D3.A D1.A 36.68,42.61 36.85,42.61 R7.1 39.61,42.61 D7.A D5.A 66.85,42.61 R10.1 69.61,42.61 D11.A D9.A | C6.2 32.95,70.61 32.95,84.17 31.49,86.42 21.31,86.46 20.32,84.49 20.32,82.47 IC1.8 | IC2.8 50.23,84.78 51.82,86.36 62.35,86.36 63.51,84.69 63.51,71.17 C4.2 | C1.2 90.77,68.49 92.88,70.61 92.88,85.61 92.14,86.35 81.98,86.35 80.37,84.73 80.37,82.52 IC3.8
  Bottom 0.254: v56.24,24.28 v63.09,24.28 | 12.35,12.3 12.35,14.89 | 109.5,9.49 100.42,9.49 99.77,10.15 99.77,13.86 99.25,14.37 Q1.3 90.78,15.52 85.57,15.52 84.18,16.92 79.6,16.92 | 92.42,41.06 91.3,41.06 90.23,42.13 | U$23.8 109.3,37.18 | 67.83,24.69 67.83,18.8 69.65,16.98 | LED2.K 79.09,16.41
  Bottom 0.305: 109.3,37.18 U$19.B14 | 92.42,41.06 U$23.15 | D9.A 90.23,42.13 | v67.96,24.82 67.83,24.69 | 69.65,16.98 v69.7,16.98 | 79.09,16.41 79.6,16.92
  Bottom 0.406: 12.35,14.89 R9.P$1 | 109.5,9.49 U$19.B25
  Bottom 1.27: U$7.GND 13.53,11.12 12.35,12.3 4.75,12.3 2.95,14.1 2.95,42.07 4.87,43.99 R4.1 | D9.A 92.36,44.74 92.36,61.82 90.77,63.41 C1.2 90.98,68.42 93.07,70.51 109.43,70.51 U$19.B1
  pour Bottom (isolate 0.305): 103.63,7.82 103.63,0.81 0.81,0.81 0.81,89.71 103.94,89.71 103.94,72.14 109.22,72.14 109.52,7.82
  pour Top (isolate 0.305): 103.63,7.82 103.63,0.81 0.81,0.81 0.81,89.71 103.94,89.71 103.94,72.14 109.22,72.14 109.52,7.82
KILL  (via drill 0.5)
  Top 0.254: v24.04,85.02 29.65,85.02 30.28,84.39 30.28,80.56 29.65,79.94 25.95,79.94 24.2,78.18 | 24.2,77.46 IC1.11 | IC2.11 54.04,77.81 56.14,79.91 59.65,79.91 60.41,80.67 60.41,84.13 59.45,85.1 54.11,85.1 | IC2.6 v47.74,84.78 v47.7,87.43 | 84.04,77.74 86.19,79.9 89.85,79.9 90.63,80.67 90.63,84.67 v90.65,84.59 | v17.69,85.04 17.69,86.83 18.29,87.43 v41,87.43 | v47.7,87.43 v70.46,87.43 | 77.69,87.39 v77.69,84.69 IC3.6 | v83.92,84.63 90.65,84.73 | v99.03,63.98 98.97,33.98 | 97.97,78.85 v97.97,68.97 | 94.62,84.69 97.98,81.34 97.98,78.87 | v103.36,33.67 103.46,12.2 R3.P$2
  Top 0.305: 98.97,33.98 v98.95,33.85
  Top 0.406: 24.2,78.18 24.2,77.46 | v54.05,84.84 54.11,85.1 | IC2.6 | 84.04,77.74 IC3.11 | 90.65,84.73 v90.65,84.59 | v47.7,87.43 | v77.72,87.43 77.69,87.39 | v94.34,84.59 94.62,84.69 | 97.98,78.87 97.97,78.85
  Bottom 0.254: IC1.6 v17.69,85.04 | 17.68,85.05 24,85.05 | v41,87.43 v47.7,87.43 | v70.46,87.43 v77.72,87.43 | 77.83,84.73 v83.92,84.63 | v90.65,84.59 v94.34,84.59 | R3.P$2 109.34,11.82 U$19.B24 | v47.74,84.78 47.9,85.15 v54.05,84.84
  Bottom 0.305: v103.36,33.67 103.34,33.79 v98.95,33.85 | v97.97,68.97 v99.03,63.98
  Bottom 0.406: v17.69,85.04 17.68,85.05 | 24,85.05 v24.04,85.02 | v77.69,84.69 77.83,84.73
N$1  (via drill 0.5)
  Top 0.254: 42.88,11.92 41.31,11.92 41.31,15.71 IC5.13 45.38,15.71 46.08,16.41 v46.08,17.93 | v51.92,26.31 51.46,26.77 U$18.7
  Top 0.406: IC5.10 42.88,11.92
  Bottom 0.254: v46.08,17.93 46.08,24.54 47.85,26.31 v51.92,26.31
N$3
  Bottom 0.254: Q1.1 89.39,12.13 R2.P$1 88.04,10.84 86.53,9.34 74.56,9.34 LED2.A
N$4  (via drill 0.5, 0.6)
  Top 0.254: 46.42,78.78 47.44,79.81 54.31,79.81 55.28,80.77 55.28,82.35 | IC2.5 46.42,78.8 45.31,79.91 35.41,79.91 34.39,78.13 v34.39,71.27
  Top 0.406: IC2.5 46.42,78.78 | 55.28,82.35 IC2.12 | v46.58,9.3 42.94,9.3 IC5.8
  Bottom 0.254: v34.39,71.27 34.39,42.06 33.38,41.05 27.53,41.05 26.52,40.03 26.52,6.5 27.79,5.23 44.81,5.23 46.58,7.01 v46.58,9.3
N$5  (via drill 0.5)
  Top 0.254: IC1.12 25.31,80.75 24.48,79.92 17.48,79.92 16.48,78.92 | 36.71,14.42 33.96,14.42 28.03,15.52 28.03,17.07 28.03,19.47 26.26,21.23 5.18,21.23 4.42,22 v4.42,48.67 | IC1.5 16.42,78.8 15.22,79.99 7.74,79.99 4.42,77.18 v4.42,62.38
  Top 0.305: 36.71,14.42 IC5.3
  Top 0.406: 16.48,78.92 16.48,77.36 IC1.5
  Bottom 0.254: v4.42,48.67 v4.42,62.38
N$6  (via drill 0.5)
  Top 0.254: 28.93,10.57 26.53,12.97 26.53,17.07 25.25,18.35 v25.25,19.2 | v22.71,22.5 7.21,22.5 5.69,24.03 v5.69,50.7
  Top 0.305: IC5.6 36.67,10.57 28.93,10.57
  Bottom 0.254: 18.96,79.15 19.73,79.92 21.98,79.92 22.73,80.67 | IC1.7 18.96,78.97 17.94,79.99 8.66,79.99 6.39,77.72 | v5.69,50.7 5.69,76.91 | v25.25,19.2 25.25,20.98 23.72,22.5 v22.71,22.5
  Bottom 0.406: IC1.7 18.96,79.15 | 22.73,80.67 22.73,82.34 IC1.10 | 5.69,76.91 6.39,77.72
N$7
  Top 1.27: D1.C D2.A 24.85,52.61 X1.1
  Bottom 0.406: R1.P$1 22.65,49.66 X1.1
  Bottom 1.27: IC1.2 12.61,84.3 14.03,86.46 26.73,86.41 27.8,84.05 27.73,82.5 IC1.14 31.77,82.38 32.98,81.17 32.98,53.92 31.73,52.67 30.29,52.67 D2.A
N$8
  Top 1.27: D3.C D4.A 20.11,52.61 X1.2 | IC1.3 13.88,75.33 14.84,74.37 25.07,74.37 26.6,75.89 26.6,77.29 IC1.13
  Bottom 0.406: LED1.A 16.23,45.69 D3.C
  Bottom 1.27: IC1.3 13.88,54.96 D4.A
N$9
  Top 0.406: LED1.K R1.P$2
N$10  (via drill 0.5)
  Top 0.254: v45.06,13.11 42.94,13.11
  Top 0.406: 42.94,13.11 IC5.11
  Bottom 0.254: 48.96,78.63 50.19,79.86 51.97,79.86 52.83,80.72 52.83,82.32 | IC2.7 48.96,78.55 47.85,79.65 37.19,79.65 35.41,77.88 35.41,41.55 34.14,40.28 28.55,40.28 27.53,39.27 27.53,7.01 28.3,6.25 44.55,6.25 45.57,7.26 45.57,12.6 v45.06,13.11
  Bottom 0.406: IC2.7 48.96,78.63 | 52.83,82.32 IC2.10
N$11
  Top 1.27: D5.C D6.A 55.6,52.61 X3.1
  Bottom 0.406: R5.P$1 58.31,48.31 D5.C
  Bottom 1.27: IC2.2 42.61,84.18 43.73,86.11 56.8,86.16 57.87,84.38 57.87,82.4 IC2.14 62.87,82.38 63.36,81.89 63.36,53.4 62.7,52.74 60.36,52.74 D6.A
N$12
  Top 1.27: D7.C D8.A 50.86,52.61 X3.2 | IC2.3 43.88,75.59 45.21,74.26 55.83,74.26 56.6,75.02 56.6,77.28 IC2.13
  Bottom 0.406: LED3.A 46.23,45.69 D7.C
  Bottom 1.27: IC2.3 43.88,54.96 D8.A
N$13
  Top 0.254: 56.31,9.36 56.28,8.19 67.41,8.19 IC6.1
  Top 0.406: 56.31,9.36 IC4.8
N$14
  Top 0.406: LED3.K R5.P$2
N$16  (via drill 0.5)
  Top 0.254: 76.42,78.67 77.59,79.84 84.73,79.84 85.22,80.33 85.22,82.29 IC3.12 | IC6.3 67.44,11.84 69.95,11.84 70.21,11.58 70.21,5.49 69.44,4.72 30.33,4.72 29.36,5.69 v29.36,9.55 | IC3.5 76.42,78.52 75.03,79.91 66.14,79.91 65.13,78.89 v65.13,71.53
  Top 0.406: IC3.5 76.42,78.67
  Bottom 0.254: v65.13,71.53 65.13,38.76 63.6,37.24 30.33,37.24 29.36,36.73 v29.36,9.55
N$17  (via drill 0.5)
  Top 0.254: v30.33,8.53 30.33,6.5 31.34,5.49 60.5,5.49 v63.95,5.52 | v63.96,10.86 63.96,15.35 64.31,15.7 67.36,15.7
  Top 0.305: IC6.6 67.44,15.65
  Top 0.406: 67.36,15.7 IC6.6
  Bottom 0.254: 78.96,78.4 80.46,79.9 81.86,79.9 82.78,80.81 | 78.96,78.77 77.83,79.91 67.16,79.91 65.89,78.64 65.89,38.51 63.86,36.47 30.58,36.47 30.33,35.97 v30.33,8.53 | v63.95,5.52 v63.95,10.85
  Bottom 0.406: 78.96,78.4 IC3.7 78.96,78.77 | 82.78,80.81 IC3.10 | v63.95,10.85 v63.96,10.86
N$18
  Top 1.27: D9.C D10.A 85.6,52.61 X4.1
  Bottom 0.406: R8.P$1 88.31,48.31 D9.C
  Bottom 1.27: IC3.2 72.61,84.47 73.69,86.06 86.99,86.06 87.94,84.75 87.94,82.47 IC3.14 89.62,82.38 91,81 91,71.77 88.32,69.09 88.32,54.52 D10.A
N$19
  Top 1.27: D11.C D12.A 80.86,52.61 X4.2 | IC3.3 73.88,74.9 74.74,74.04 85.56,74.04 86.53,75.01 86.53,77.25 IC3.13
  Bottom 0.406: LED4.A 76.23,45.69 D11.C
  Bottom 1.27: IC3.3 73.88,54.96 D12.A
N$21
  Top 0.406: LED4.K R8.P$2
N$22  (via drill 0.5)
  Top 0.254: Q2.1 95.29,9.13 95.29,17.46 v95.3,17.48 95.3,21.28 95.28,21.3 95.29,21.31 92,24.61 93.15,24.61 v94.18,23.57
  Top 0.305: 92,24.61 v91.69,26.98
  Bottom 0.254: U$13.24 U$13.1 98.76,29.44 C7.1 | C10.2 C9.2 | 87.13,30.13 87.59,30.59 91.4,30.59 91.96,30.03 91.96,28.26 U$13.24 | v91.69,26.98 92,28.29 | 89.22,23.06 U$13.16 U$13.17 94.04,23.71 v94.18,23.57 | v95.3,17.48 95.24,17.53 C10.2 | C10.2 C12.2
  Bottom 0.305: 87.13,30.13 C11.2 | 91.96,28.26 | U$13.24 92.03,28.26 92,28.29 | v91.69,26.98 92,26.96 | 92,26.96 U$13.22 92,26.96 | v99.44,17.53 97.9,17.53 C12.2 | 89.22,23.06 C8.2
  Bottom 0.406: C12.2 97.9,17.53
N$23  (via drill 0.5)
  Top 0.254: 67.31,10.57 65.89,10.57 65.89,14.38 | 65.89,14.38 65.95,14.44 IC6.5 | U$17.7 64.87,28.18 v64.87,26.57 | 65.89,14.38 v64.87,14.38
  Top 0.406: 67.31,10.57 IC6.2
  Bottom 0.254: v64.87,14.38 v64.87,26.57
N$24  (via drill 0.5)
  Top 0.254: v31.34,9.3 31.34,7.26 32.36,6.25 68.47,6.35 | v98.59,6.33 98.59,20.7 98.87,22.3 98.87,26.93 v101.8,26.91
  Top 0.406: 68.47,6.35 v68.51,6.42
  Top 1.27: R10.2 68.23,75.67 69.86,77.3 IC3.1 71.34,73.19 72.75,71.78 87.73,71.78 89.26,73.3 89.26,77.44 | 89.26,77.44 89.26,77.88 | 89.26,77.44 IC3.15
  Bottom 0.254: R10.2 68.23,47.45 66.9,46.13 66.9,38.51 63.86,35.46 31.85,35.46 31.34,34.95 v31.34,9.3 | v68.51,6.42 98.47,6.21 | U$13.4 101.19,26.3 v101.8,26.91
  Bottom 0.305: U$13.4
  Bottom 0.406: 98.47,6.21 v98.59,6.33
N$25
  Top 0.254: IC5.9 IC4.6
N$26  (via drill 0.5)
  Top 0.254: IC5.2 38.56,15.71 38.56,11.92 36.73,11.92 | 38.21,26.56 U$16.7
  Top 0.305: 36.67,15.77 IC5.2 36.67,15.65 v34.65,15.65 | v38.46,26.31 38.21,26.56
  Top 0.406: IC5.5 36.73,11.92
  Bottom 0.254: v38.46,26.31 38.46,18.95 37.95,18.44 33.63,18.44
  Bottom 0.305: 33.63,18.44 33.63,15.65 v34.65,15.65
N$27  (via drill 0.5)
  Top 0.254: v47.56,16.92 47.56,14.42 49.73,14.42
  Top 0.305: IC5.1 36.64,17.07 v34.76,17.07
  Top 0.406: 49.73,14.42 IC4.3
  Bottom 0.254: v34.76,17.07 v47.56,16.92
N$28
  Bottom 0.305: Q1.2 91.31,11.82 R3.P$1
N$29  (via drill 0.5)
  Top 0.254: v28.55,7.77 28.55,4.98 29.82,3.71 99.16,3.71 100.28,4.83 100.3,21.7 100.34,25.77 v101.78,25.76
  Top 1.27: R7.2 38.23,75.67 39.86,77.3 IC2.1 41.34,74.23 43.03,72.54 58.01,72.54 59.28,73.81 59.28,77.14 IC2.15
  Bottom 0.254: 38.2,51.21 38.2,47.9 36.42,46.13 36.42,41.3 34.65,39.52 29.31,39.52 28.55,38.76 v28.55,7.77 | U$13.5 101.67,25.66 v101.78,25.76
  Bottom 0.305: U$13.5
  Bottom 0.406: R7.2 38.23,51.23 38.2,51.21
N$30  (via drill 0.5)
  Top 0.254: v8.23,52.48 8.23,46.63 6.96,45.36 6.96,25.3 8.23,24.03 v19.66,24.03 | v23.98,12.6 26.52,10.06 26.52,5.23 29.06,2.69 99.67,2.69 100.99,4.01 100.99,23.85 v101.73,24.59
  Top 1.27: R4.2 8.23,75.67 9.86,77.3 IC1.1 11.34,74.56 13.22,72.69 27.31,72.69 29.19,74.57 29.19,77.23 IC1.15
  Bottom 0.254: v8.23,52.48 R4.2 | 19.91,23.77 19.91,15.14 22.45,12.6 v23.98,12.6 | U$13.6 101.2,25.01 v101.73,24.59
  Bottom 0.406: 19.91,23.77 v19.66,24.03
N$32  (via drill 0.5)
  Top 0.254: v101.02,39.78 101.32,38.63 100.5,36.98 100.47,36.96 100.47,32.79 97.6,28.21 v97.6,24.34
  Bottom 0.254: 98.74,24.34 v97.6,24.34
  Bottom 0.305: U$23.4 v101.02,39.78 | U$13.7 98.74,24.34
N$33
  Bottom 0.254: 91.88,25.65 89.93,27.6
  Bottom 0.305: 89.93,27.6 C11.1 | 91.88,25.65 U$13.20
N$34  (via drill 0.5)
  Top 0.254: v94.84,25.91 94.84,24.06 v96.87,22.03
  Bottom 0.254: U$13.21 94.44,26.31 v94.84,25.91
  Bottom 0.305: v96.87,22.03 96.87,21.37 C12.1
N$35  (via drill 0.5)
  Top 0.254: v99.93,37.97 99.9,33.08 96.6,28.37 v96.6,23.46
  Bottom 0.254: 96.73,23.46 97.14,23.05 U$13.9
  Bottom 0.305: U$23.7 v99.93,37.97 | v96.6,23.46 96.73,23.46 | U$13.9
N$36  (via drill 0.5)
  Top 0.254: IC4.2 IC4.1 | IC5.4 34.46,13.17 v34.39,13.11 | v51.92,15.65 49.8,15.65 | v49.63,22.25 43.54,22.25 v43.03,22.76 | v43.03,25.55 42.27,26.31 40.49,26.31 40.16,26.64 U$16.4
  Top 0.406: 49.8,15.65 IC4.2 | IC4.1 49.63,17.08 v49.63,18.03
  Bottom 0.254: v34.39,13.11 39.22,13.11 39.73,13.61 39.73,15.14 40.23,15.65 v51.92,15.65 | v43.03,22.76 v43.03,25.55
  Bottom 0.406: v49.63,18.03 v49.63,22.25
N$37  (via drill 0.5)
  Top 0.254: IC4.4 IC4.5 | IC4.4 46.31,13.17 46.31,14.42 42.88,14.42 | IC4.4 52.75,13.17 v53.44,13.87 | v53.44,26.57 53.44,28.31 U$18.4
  Top 0.406: IC5.12 42.88,14.42
  Bottom 0.254: v53.44,13.87 v53.44,26.57
N$38  (via drill 0.5)
  Top 0.254: IC4.9 IC4.10 | 69.12,13.17 IC6.4 | v66.65,26.57 66.65,28.33
  Top 0.305: 66.65,28.33 U$17.4
  Top 0.406: IC4.10 53.51,11.9 v53.44,11.84 | v69.19,13.11 69.12,13.17
  Bottom 0.254: v53.44,11.84 63.6,11.84 64.87,13.11 66.65,13.11 | 66.65,13.11 v69.19,13.11 | 66.65,13.11 v66.65,26.57
N$39  (via drill 0.5)
  Top 0.254: 22.54,19.06 R9.P$2 22.54,12.2 24.97,9.77 24.97,5.24 28.33,1.88 100.07,1.88 101.96,3.77 101.96,21.47 102.73,22.14 v102.56,29.22
  Top 0.406: 22.54,19.06 R6.P$1
  Bottom 0.254: U$13.3 100.3,26.96 v102.56,29.22
N$40
  Bottom 0.305: R11.P$1 90.24,9.74 Q2.2
PWM_X0
  Top 0.254: U$19.A2 105.85,67.88 105.77,67.97 95.01,67.98 94.08,67.06 94.08,35.71 93.07,34.7 40.23,34.7 38.86,33.32 U$16.6
PWM_X1
  Top 0.254: U$19.A3 105.85,65.34 105.26,65.94 105.26,66.95 104.75,67.46 95.35,67.46 94.59,66.7 94.59,35.46 93.07,33.93 40.27,33.93 39.51,33.17 U$16.5
PWM_Y0
  Top 0.254: 105.35,62.8 104.75,63.4 104.75,66.45 104.24,66.95 95.86,66.95 95.1,66.19 95.1,35.2 93.32,33.43 52.68,33.43 52.11,32.86 U$18.6
  Top 0.305: 105.35,62.8 U$19.A4
PWM_Y1
  Top 0.254: U$19.A5 104.58,60.26 103.99,60.86 103.99,65.94 103.48,66.45 96.62,66.45 95.86,65.68 95.86,35.2 93.57,32.92 53.44,32.92 52.76,32.24 52.76,31.72 | U$18.5 52.76,31.72 | 52.76,31.72 52.77,31.73
PWM_Z0
  Top 0.254: U$19.A6 104.08,57.72 103.48,58.32 103.48,65.43 102.97,65.94 97.38,65.94 96.62,65.18 96.62,35.2 93.83,32.41 65.89,32.41 65.36,31.88 U$17.6
PWM_Z1
  Top 0.254: U$19.A7 103.57,55.18 102.97,55.78 102.97,64.92 102.46,65.43 98.15,65.43 97.38,64.67 97.38,35.2 94.08,31.9 66.65,31.9 66.01,31.26 U$17.5
SEL_X  (via drill 0.5)
  Top 0.254: U$16.1 42.11,28.7 v43.03,29.62
  Top 0.406: v70.21,26.31 77.79,26.31 SW1.8
  Bottom 0.254: v43.03,29.62 66.9,29.62 v70.21,26.31
SEL_Y
  Top 0.254: 77.06,20.98 61.82,20.98 61.06,21.74 61.06,27.33 60.05,28.34 U$18.1
  Top 0.406: SW1.7 80.37,26.32 80.37,24.28 77.06,20.98
SEL_Z
  Top 0.254: U$17.1 82.91,28.35 82.89,28.33 SW1.6
SIDE  (via drill 0.5)
  Top 0.254: SW1.5 90.48,31.38 94.48,31.38 98.23,35.13 v98.23,43.1
  Bottom 0.305: v98.23,43.1 98.28,42.74 U$23.1

### Text on the board
tPlace: SEL X | SEL Y | SEL Z | SIDE | 3-AXIS THRUSTER CONTROLLER | M BUJOLD 2013